# EAGLE design S181A (EAGLE 6.6.0)
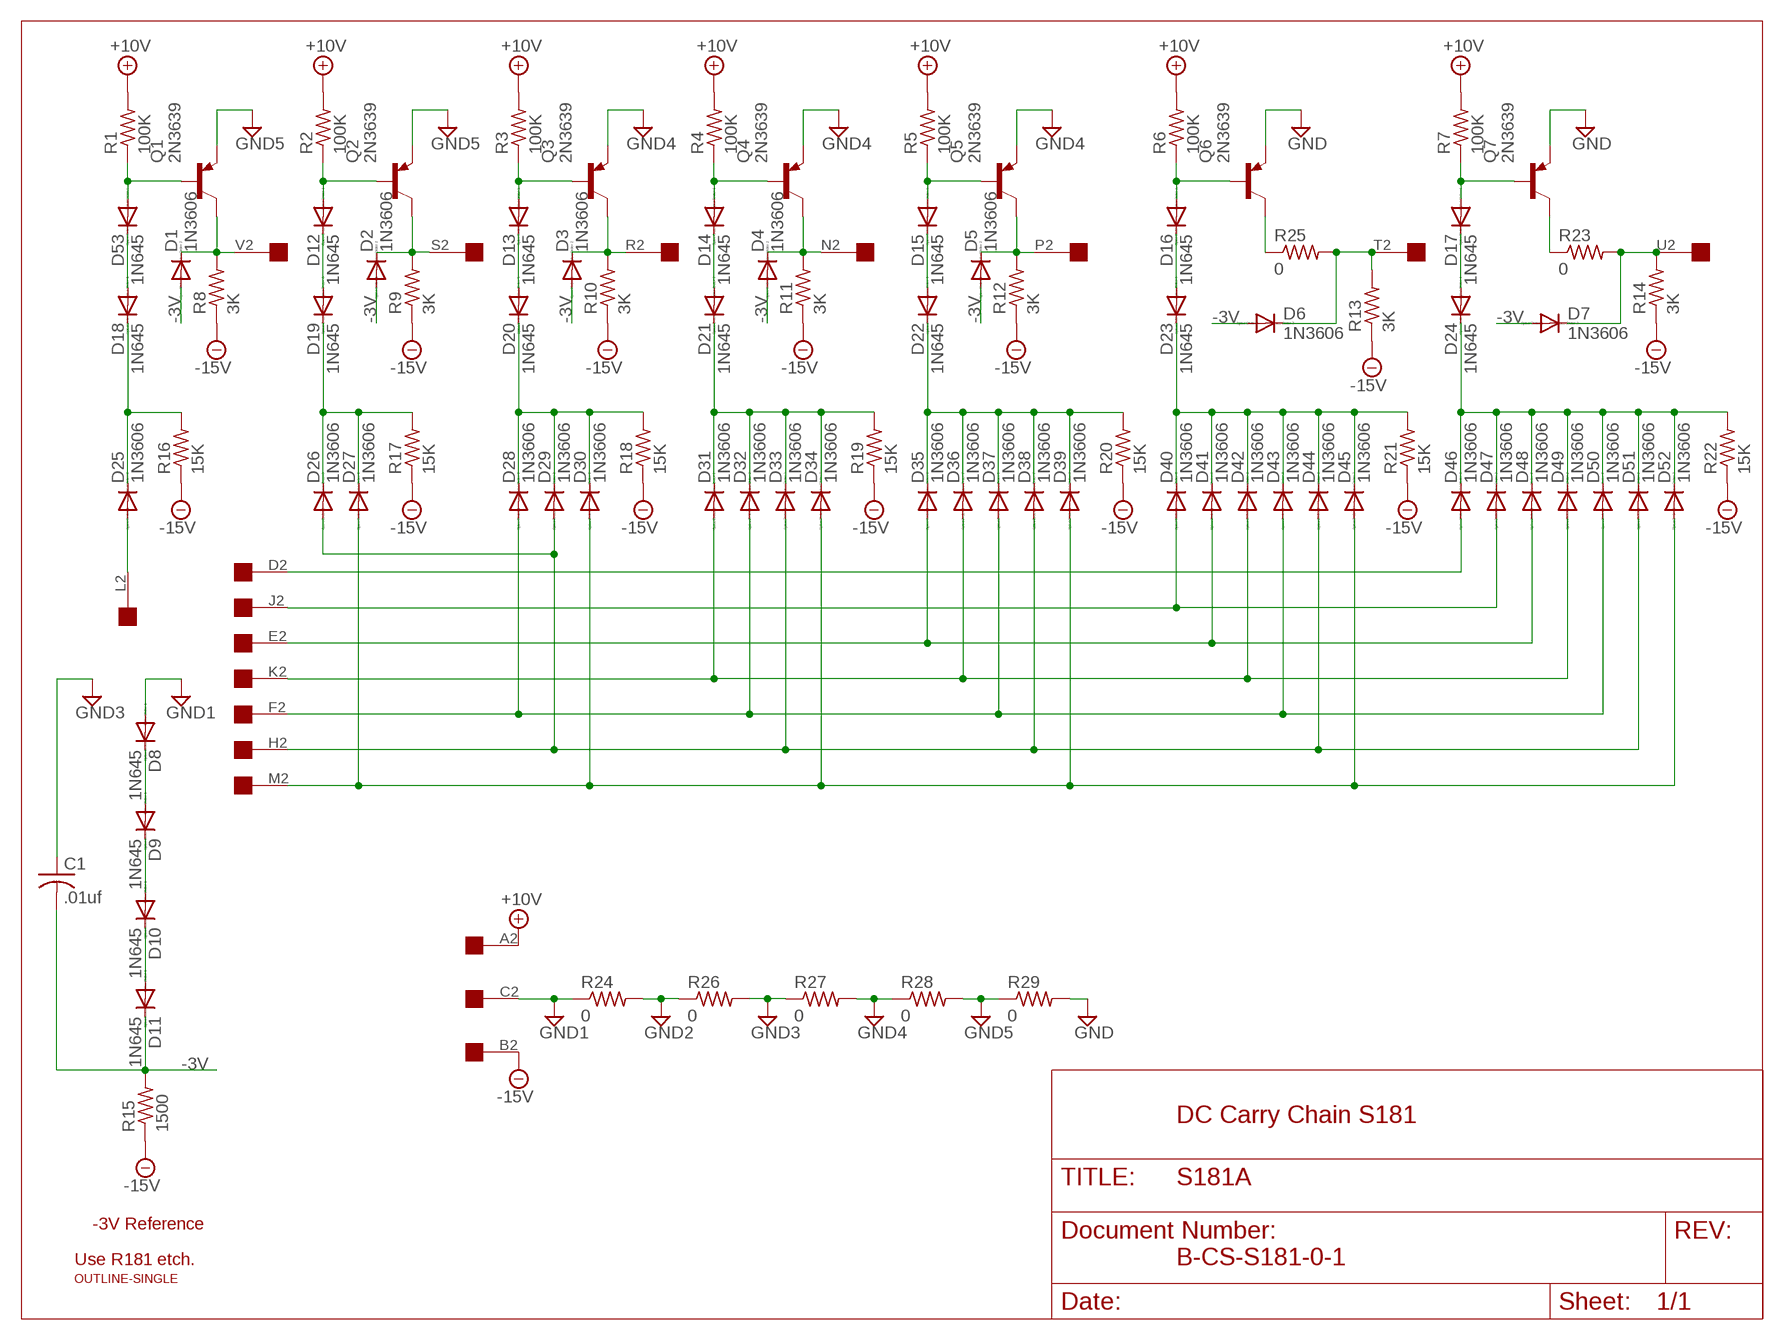
[diagram p0: schematic, sheet 1]

## Parts
C1  .01uf  C-US050-025X075  [C050-025X075]
D1  1N3606  1N4148DO35-10  [DO35-10]
D2  1N3606  1N4148DO35-10  [DO35-10]
D3  1N3606  1N4148DO35-10  [DO35-10]
D4  1N3606  1N4148DO35-10  [DO35-10]
D5  1N3606  1N4148DO35-10  [DO35-10]
D6  1N3606  1N4148DO35-10  [DO35-10]
D7  1N3606  1N4148DO35-10  [DO35-10]
D8  1N645  1N4148DO35-10  [DO35-10]
D9  1N645  1N4148DO35-10  [DO35-10]
D10  1N645  1N4148DO35-10  [DO35-10]
D11  1N645  1N4148DO35-10  [DO35-10]
D12  1N645  1N4148DO35-10  [DO35-10]
D13  1N645  1N4148DO35-10  [DO35-10]
D14  1N645  1N4148DO35-10  [DO35-10]
D15  1N645  1N4148DO35-10  [DO35-10]
D16  1N645  1N4148DO35-10  [DO35-10]
D17  1N645  1N4148DO35-10  [DO35-10]
D18  1N645  1N4148DO35-10  [DO35-10]
D19  1N645  1N4148DO35-10  [DO35-10]
D20  1N645  1N4148DO35-10  [DO35-10]
D21  1N645  1N4148DO35-10  [DO35-10]
D22  1N645  1N4148DO35-10  [DO35-10]
D23  1N645  1N4148DO35-10  [DO35-10]
D24  1N645  1N4148DO35-10  [DO35-10]
D25  1N3606  1N4148DO35-10  [DO35-10]
D26  1N3606  1N4148DO35-10  [DO35-10]
D27  1N3606  1N4148DO35-10  [DO35-10]
D28  1N3606  1N4148DO35-10  [DO35-10]
D29  1N3606  1N4148DO35-10  [DO35-10]
D30  1N3606  1N4148DO35-10  [DO35-10]
D31  1N3606  1N4148DO35-10  [DO35-10]
D32  1N3606  1N4148DO35-10  [DO35-10]
D33  1N3606  1N4148DO35-10  [DO35-10]
D34  1N3606  1N4148DO35-10  [DO35-10]
D35  1N3606  1N4148DO35-10  [DO35-10]
D36  1N3606  1N4148DO35-10  [DO35-10]
D37  1N3606  1N4148DO35-10  [DO35-10]
D38  1N3606  1N4148DO35-10  [DO35-10]
D39  1N3606  1N4148DO35-10  [DO35-10]
D40  1N3606  1N4148DO35-10  [DO35-10]
D41  1N3606  1N4148DO35-10  [DO35-10]
D42  1N3606  1N4148DO35-10  [DO35-10]
D43  1N3606  1N4148DO35-10  [DO35-10]
D44  1N3606  1N4148DO35-10  [DO35-10]
D45  1N3606  1N4148DO35-10  [DO35-10]
D46  1N3606  1N4148DO35-10  [DO35-10]
D47  1N3606  1N4148DO35-10  [DO35-10]
D48  1N3606  1N4148DO35-10  [DO35-10]
D49  1N3606  1N4148DO35-10  [DO35-10]
D50  1N3606  1N4148DO35-10  [DO35-10]
D51  1N3606  1N4148DO35-10  [DO35-10]
D52  1N3606  1N4148DO35-10  [DO35-10]
D53  1N645  1N4148DO35-10  [DO35-10]
Q1  2N3639  2N3637  [TO39]
Q2  2N3639  2N3637  [TO39]
Q3  2N3639  2N3637  [TO39]
Q4  2N3639  2N3637  [TO39]
Q5  2N3639  2N3637  [TO39]
Q6  2N3639  2N3637  [TO39]
Q7  2N3639  2N3637  [TO39]
R1  100K  R-US_0207/10  [0207/10]
R2  100K  R-US_0207/10  [0207/10]
R3  100K  R-US_0207/10  [0207/10]
R4  100K  R-US_0207/10  [0207/10]
R5  100K  R-US_0207/10  [0207/10]
R6  100K  R-US_0207/10  [0207/10]
R7  100K  R-US_0207/10  [0207/10]
R8  3K  R-US_0207/10  [0207/10]
R9  3K  R-US_0207/10  [0207/10]
R10  3K  R-US_0207/10  [0207/10]
R11  3K  R-US_0207/10  [0207/10]
R12  3K  R-US_0207/10  [0207/10]
R13  3K  R-US_0207/10  [0207/10]
R14  3K  R-US_0207/10  [0207/10]
R15  1500  R-US_0207/10  [0207/10]
R16  15K  R-US_0207/10  [0207/10]
R17  15K  R-US_0207/10  [0207/10]
R18  15K  R-US_0207/10  [0207/10]
R19  15K  R-US_0207/10  [0207/10]
R20  15K  R-US_0207/10  [0207/10]
R21  15K  R-US_0207/10  [0207/10]
R22  15K  R-US_0207/10  [0207/10]
R23  0  R-US_0207/10  [0207/10]
R24  0  R-US_0207/10  [0207/10]
R25  0  R-US_0207/10  [0207/10]
R26  0  R-US_0207/10  [0207/10]
R27  0  R-US_0207/10  [0207/10]
R28  0  R-US_0207/10  [0207/10]
R29  0  R-US_0207/10  [0207/10]
U$1  OUTLINE-SINGLE  [SINGLE]
U$2  EDGE-1  [EDGE-CON1]

## Nets
+10V [Power]: R1.2 R2.2 R3.2 R4.2 R5.2 R6.2 R7.2 U$2.A2
-3V [Power]: C1.2 D1.A D2.A D3.A D4.A D5.A D6.A D7.A D11.C R15.2
-15V [Power]: R8.1 R9.1 R10.1 R11.1 R12.1 R13.1 R14.1 R15.1 R16.1 R17.1 R18.1 R19.1 R20.1 R21.1 R22.1 U$2.B2
GND [Power]: Q6.1(E) Q7.1(E) R29.2
GND1 [Power]: D8.A R24.1 U$2.C2
GND2 [Power]: R24.2 R26.1
GND3: C1.1 R26.2 R27.1
GND4 [Power]: Q3.1(E) Q4.1(E) Q5.1(E) R27.2 R28.1
GND5 [Power]: Q1.1(E) Q2.1(E) R28.2 R29.1
N: D4.C Q4.3(C) R11.2 U$2.N2
N$1: D26.A D29.A D33.A D38.A D44.A D51.A U$2.H2
N$2: D12.A Q2.2(B) R2.1
N$3: D8.C D9.A
N$5: D25.A U$2.L2
N$6: D19.C D26.C D27.C R17.2
N$7: D12.C D19.A
N$8: D13.A Q3.2(B) R3.1
N$9: D27.A D30.A D34.A D39.A D45.A D52.A U$2.M2
N$10: D35.A D41.A D48.A U$2.E2
N$11: D20.C D28.C D29.C D30.C R18.2
N$12: D13.C D20.A
N$13: D9.C D10.A
N$14: D28.A D32.A D37.A D43.A D50.A U$2.F2
N$15: D31.A D36.A D42.A D49.A U$2.K2
N$16: D10.C D11.A
N$17: D7.C R14.2 R23.2 U$2.U2
N$18: D14.A Q4.2(B) R4.1
N$19: D53.A Q1.2(B) R1.1
N$20: D40.A D47.A U$2.J2
N$21: D6.C R13.2 R25.2 U$2.T2
N$22: D18.C D25.C R16.2
N$23: D18.A D53.C
N$24: D46.A U$2.D2
N$26: D21.C D31.C D32.C D33.C D34.C R19.2
N$27: D14.C D21.A
N$33: D15.A Q5.2(B) R5.1
N$34: D22.C D35.C D36.C D37.C D38.C D39.C R20.2
N$35: D15.C D22.A
N$36: D16.A Q6.2(B) R6.1
N$37: D23.C D40.C D41.C D42.C D43.C D44.C D45.C R21.2
N$38: D16.C D23.A
N$40: D17.A Q7.2(B) R7.1
N$41: D24.C D46.C D47.C D48.C D49.C D50.C D51.C D52.C R22.2
N$42: D17.C D24.A
P: D5.C Q5.3(C) R12.2 U$2.P2
R: D3.C Q3.3(C) R10.2 U$2.R2
S: D2.C Q2.3(C) R9.2 U$2.S2
T: Q6.3(C) R25.1
U: Q7.3(C) R23.1
V: D1.C Q1.3(C) R8.2 U$2.V2

## Notes on the sheet
- DC Carry Chain S181
- -3V Reference
- Use R181 etch. | B-CS-S181-0-1

## Library data of the parts
C1 = rcl:C-US: CAPACITOR, American symbol
D1-D53 = diode:1N4148: DIODE high speed (Philips)
Q1-Q7 = transistor-pnp:2N3637*: PNP Transistror
R1-R29 = rcl:R-US_: RESISTOR, American symbol
U$1 = dec-con:OUTLINE-*: Board outlines for DEC boards.
U$2 = dec-con:EDGE-1: Single-Sided DEC Edge Connector -- (side 2)

## Net classes
1 Power: width 0.813 mm

## Board
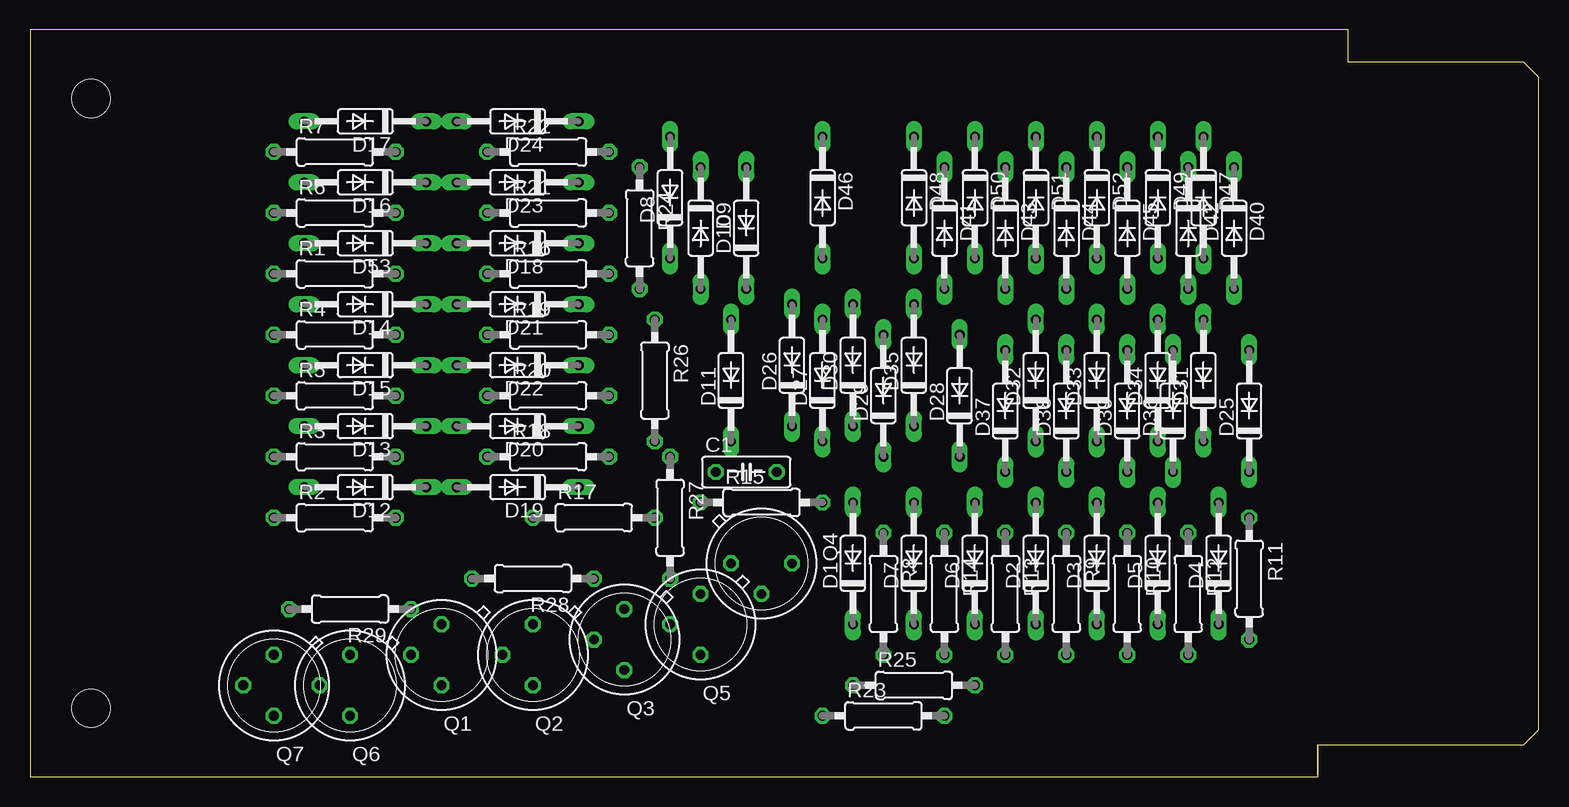
[diagram p1: board, top side]
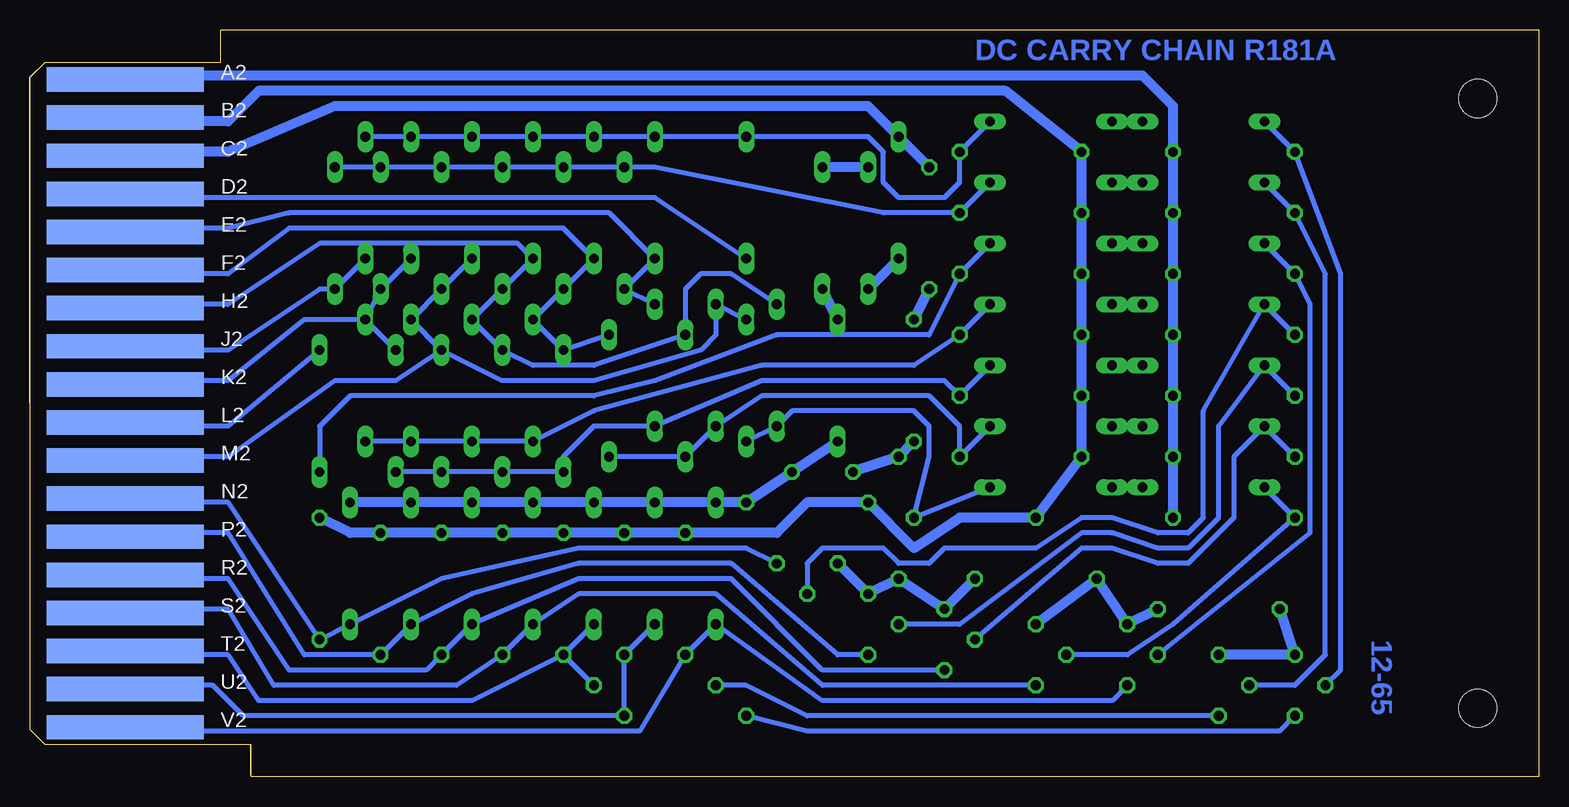
[diagram p2: board, bottom side, seen from below]

Size 125.73 x 62.23 mm. Coordinates in mm from the lower left corner, seen from the top.
Copper layers (1+16): Top 0.035mm / dielectric 1.5mm / Bottom 0.035mm
Design rules "16mils": minimum track width 16mil, minimum drill 32mil, track to track 15mil, track to pad 10mil, pad to pad 10mil, via to via 10mil, smd to smd 10mil, copper to edge 13mil, drill to drill 10mil, minimum pad ring 10mil, minimum via ring 8mil, stop-mask expansion 0mil, vias tented up to drill 0mil, thermal gap 10mil

### Footprints (pad centres in the part's own frame; a part is rotated, then mirrored left to right if it is on the bottom)
C050-025X075 = drill 0.813 octagon: 1 -2.54,0; 2 2.54,0
DO35-10 = drill 0.813 long: A 5.08,0; C -5.08,0
TO39 = drill 0.813 octagon: 1 0,-2.54; 2 2.54,0; 3 0,2.54
0207/10 = drill 0.813 octagon: 1 -5.08,0; 2 5.08,0
SINGLE = hole 3.175: 120.65,56.515; 120.65,5.715
EDGE-CON1 = smd 13.106 x 2.032 bottom: A2 7.938,4.128; B2 7.938,7.303; C2 7.938,10.477; D2 7.938,13.652; E2 7.938,16.828; F2 7.938,20.003; H2 7.938,23.177; J2 7.938,26.352; K2 7.938,29.527; L2 7.938,32.703; M2 7.938,35.877; N2 7.938,39.053; P2 7.938,42.227; R2 7.938,45.403; S2 7.938,48.578; T2 7.938,51.752; U2 7.938,54.928; V2 7.938,58.102

### Placement (x,y rotation side)
C1  59.69,25.4 0 top
D1  68.58,17.78 90 top
D2  83.82,17.78 90 top
D3  88.9,17.78 90 top
D4  99.06,17.78 90 top
D5  93.98,17.78 90 top
D6  78.74,17.78 90 top
D7  73.66,17.78 90 top
D8  53.34,48.26 90 top
D9  55.88,45.72 270 top
D10  59.69,45.72 90 top
D11  58.42,33.02 90 top
D12  27.94,24.13 180 top
D13  27.94,29.21 180 top
D14  27.94,39.37 180 top
D15  27.94,34.29 180 top
D16  27.94,49.53 180 top
D17  27.94,54.61 180 top
D18  40.64,44.45 180 top
D19  40.64,24.13 180 top
D20  40.64,29.21 180 top
D21  40.64,39.37 180 top
D22  40.64,34.29 180 top
D23  40.64,49.53 180 top
D24  40.64,54.61 180 top
D25  101.6,30.48 90 top
D26  63.5,34.29 90 top
D27  66.04,33.02 90 top
D28  77.47,31.75 90 top
D29  71.12,31.75 90 top
D30  68.58,34.29 90 top
D31  97.79,33.02 90 top
D32  83.82,33.02 90 top
D33  88.9,33.02 90 top
D34  93.98,33.02 90 top
D35  73.66,34.29 90 top
D36  95.25,30.48 90 top
D37  81.28,30.48 90 top
D38  86.36,30.48 90 top
D39  91.44,30.48 90 top
D40  100.33,45.72 270 top
D41  76.2,45.72 270 top
D42  96.52,45.72 270 top
D43  81.28,45.72 270 top
D44  86.36,45.72 270 top
D45  91.44,45.72 270 top
D46  66.04,48.26 270 top
D47  97.79,48.26 270 top
D48  73.66,48.26 270 top
D49  93.98,48.26 270 top
D50  78.74,48.26 270 top
D51  83.82,48.26 270 top
D52  88.9,48.26 270 top
D53  27.94,44.45 180 top
Q1  34.29,10.16 180 top
Q2  41.91,10.16 180 top
Q3  49.53,11.43 180 top
Q4  60.96,17.78 270 top
Q5  55.88,12.7 180 top
Q6  26.67,7.62 180 top
Q7  20.32,7.62 180 top
R1  25.4,41.91 0 top
R2  25.4,21.59 0 top
R3  25.4,26.67 0 top
R4  25.4,36.83 0 top
R5  25.4,31.75 0 top
R6  25.4,46.99 0 top
R7  25.4,52.07 0 top
R8  71.12,15.24 270 top
R9  86.36,15.24 270 top
R10  91.44,15.24 270 top
R11  101.6,16.51 270 top
R12  96.52,15.24 270 top
R13  81.28,15.24 270 top
R14  76.2,15.24 270 top
R15  60.96,22.86 0 top
R16  43.18,41.91 0 top
R17  46.99,21.59 0 top
R18  43.18,26.67 0 top
R19  43.18,36.83 0 top
R20  43.18,31.75 0 top
R21  43.18,46.99 0 top
R22  43.18,52.07 0 top
R23  71.12,5.08 0 top
R24  50.8,45.72 270 top
R25  73.66,7.62 0 top
R26  52.07,33.02 270 top
R27  53.34,21.59 270 top
R28  41.91,16.51 180 top
R29  26.67,13.97 180 top
U$1  125.73,62.23 180 top
U$2  125.73,62.23 180 top

### Tracks (layer width: path | path; a pad name or v marks a point on that pad's centre or on a via)
+10V
  Bottom 0.813: U$2.A2 117.22,58.04 116.84,58.42 33.02,58.42 30.48,55.88 R7.2 R6.2 R1.2 R4.2 R5.2 R3.2 R2.2
-3V
  Bottom 0.813: D4.A D5.A D3.A D2.A D6.A D7.A D1.A R15.2 C1.2 D11.C
-15V
  Bottom 0.813: U$2.B2 116.84,54.61 109.22,54.61 106.68,57.15 44.45,57.15 R22.1 R21.1 R16.1 R19.1 R20.1 R18.1 R17.1 48.26,21.59 52.07,19.05 R15.1 60.96,22.86 63.5,20.32 R8.1 R14.1 R13.1 R9.1 R10.1 R12.1 99.06,20.32 R11.1
GND
  Bottom 0.813: Q6.1 Q7.1 R29.2
GND1
  Bottom 0.813: U$2.C2 116.84,52.07 109.22,52.07 100.33,55.88 55.88,55.88 D8.A R24.1
GND2
  Bottom 0.813: R26.1 R24.2
GND3
  Bottom 0.813: R26.2 R27.1 C1.1
GND4
  Bottom 0.813: R28.1 Q3.1 R27.2 Q5.1 Q4.1
GND5
  Bottom 0.813: R29.1 Q1.1 R28.2 Q2.1
N
  Bottom 0.406: U$2.N2 116.84,22.86 109.22,22.86 R11.2 D4.C 91.44,16.51 80.01,19.05 66.04,19.05 Q4.3
N$1
  Bottom 0.406: U$2.H2 116.84,39.37 109.22,39.37 101.6,44.45 85.09,44.45 D51.A D44.A D33.A D38.A 83.82,34.29 78.74,34.29 D29.A 71.12,40.64 69.85,41.91 67.31,41.91 D26.A
N$2
  Bottom 0.406: Q2.2 34.29,10.16 30.48,12.7 R2.1 D12.A
N$3
  Bottom 0.813: D9.A D8.C
N$5
  Bottom 0.406: U$2.L2 116.84,29.21 109.22,29.21 D25.A
N$6
  Bottom 0.406: D19.C R17.2 50.8,26.67 50.8,29.21 52.07,30.48 62.23,30.48 D26.C D27.C
N$7
  Bottom 0.406: D12.C D19.A
N$8
  Bottom 0.406: Q3.2 38.1,19.05 35.56,19.05 31.75,17.78 29.21,17.78 25.4,21.59 25.4,26.67 D13.A R3.1
N$9
  Bottom 0.406: U$2.M2 116.84,26.67 109.22,26.67 100.33,33.02 95.25,33.02 D39.A | D39.A D34.A D45.A D52.A | D39.A 86.36,33.02 78.74,33.02 69.85,35.56 68.58,36.83 D30.A D27.A
N$10
  Bottom 0.406: U$2.E2 116.84,45.72 109.22,45.72 104.14,46.99 77.47,46.99 D48.A D41.A D35.A
N$11
  Bottom 0.406: D20.C R18.2 48.26,29.21 50.8,31.75 64.77,31.75 D30.C D29.C D28.C
N$12
  Bottom 0.406: D13.C D20.A
N$13
  Bottom 0.813: D9.C D10.A
N$14
  Bottom 0.406: U$2.F2 116.84,41.91 109.22,41.91 104.14,45.72 81.28,45.72 D50.A D43.A D32.A D37.A D28.A
N$15
  Bottom 0.406: U$2.K2 116.84,33.02 109.22,33.02 102.87,38.1 D31.A | D31.A D42.A D49.A | D36.A D31.A
N$16
  Bottom 0.813: D11.A D10.C
N$17
  Bottom 0.406: U$2.U2 116.84,7.62 110.49,7.62 107.95,5.08 R23.2 R14.2 D7.C
N$18
  Bottom 0.406: R4.1 D14.A 27.94,30.48 27.94,21.59 29.21,20.32 31.75,20.32 35.56,21.59 38.1,21.59 41.91,19.05 49.53,19.05 50.8,17.78 53.34,17.78 54.61,19.05 59.69,19.05 60.96,17.78 Q4.2
N$19
  Bottom 0.406: Q1.2 19.05,20.32 19.05,39.37 R1.1 D53.A
N$20
  Bottom 0.406: U$2.J2 116.84,35.56 109.22,35.56 101.6,40.64 D40.A D47.A
N$21
  Bottom 0.406: U$2.T2 116.84,10.16 109.22,10.16 106.68,6.35 88.9,6.35 R13.2 | R25.2 R13.2 | R13.2 D6.C
N$22
  Bottom 0.406: D18.C R16.2 50.8,36.83 63.5,36.83 73.66,33.02 78.74,31.75 99.06,31.75 101.6,29.21 D25.C
N$23
  Bottom 0.406: D53.C D18.A
N$24
  Bottom 0.406: U$2.D2 115.57,48.26 73.66,48.26 D46.A
N$26
  Bottom 0.406: D21.C R19.2 52.07,34.29 64.77,34.29 78.74,30.48 D32.C D33.C D34.C D31.C
N$27
  Bottom 0.406: D14.C D21.A
N$33
  Bottom 0.406: Q5.2 48.26,12.7 38.1,20.32 35.56,20.32 31.75,19.05 29.21,19.05 26.67,21.59 26.67,29.21 D15.A R5.1
N$34
  Bottom 0.406: D22.C R20.2 49.53,33.02 64.77,33.02 D35.C 78.74,29.21 81.28,26.67 D37.C D38.C D39.C D36.C
N$35
  Bottom 0.406: D15.C D22.A
N$36
  Bottom 0.406: Q6.2 20.32,7.62 17.78,10.16 17.78,41.91 R6.1 D16.A
N$37
  Bottom 0.406: D23.C R21.2 54.61,46.99 73.66,50.8 D41.C D43.C D44.C D45.C D42.C D40.C
N$38
  Bottom 0.406: D16.C D23.A
N$40
  Bottom 0.406: Q7.2 16.51,8.89 16.51,41.91 R7.1 D17.A
N$41
  Bottom 0.406: D47.C D49.C D52.C D51.C D50.C D48.C D46.C 55.88,53.34 54.61,52.07 54.61,49.53 53.34,48.26 49.53,48.26 48.26,49.53 R22.2 D24.C
N$42
  Bottom 0.406: D17.C D24.A
P
  Bottom 0.406: U$2.P2 116.84,20.32 109.22,20.32 102.87,10.16 R12.2 D5.C 88.9,15.24 80.01,17.78 67.31,17.78 58.42,10.16 Q5.3
R
  Bottom 0.406: U$2.R2 116.84,16.51 109.22,16.51 104.14,8.89 92.71,8.89 R10.2 D3.C 80.01,16.51 67.31,16.51 59.69,8.89 Q3.3
S
  Bottom 0.406: U$2.S2 116.84,13.97 109.22,13.97 105.41,7.62 90.17,7.62 R9.2 D2.C 80.01,15.24 68.58,15.24 59.69,7.62 Q2.3
T
  Bottom 0.406: Q6.3 60.96,5.08 66.04,7.62 R25.1
U
  Bottom 0.406: Q7.3 21.59,3.81 60.96,3.81 R23.1
V
  Bottom 0.406: U$2.V2 115.57,3.81 74.93,3.81 R8.2 D1.C 59.69,6.35 35.56,6.35 Q1.3

### Text on the board
Bottom: DC CARRY CHAIN R181A | 12-65